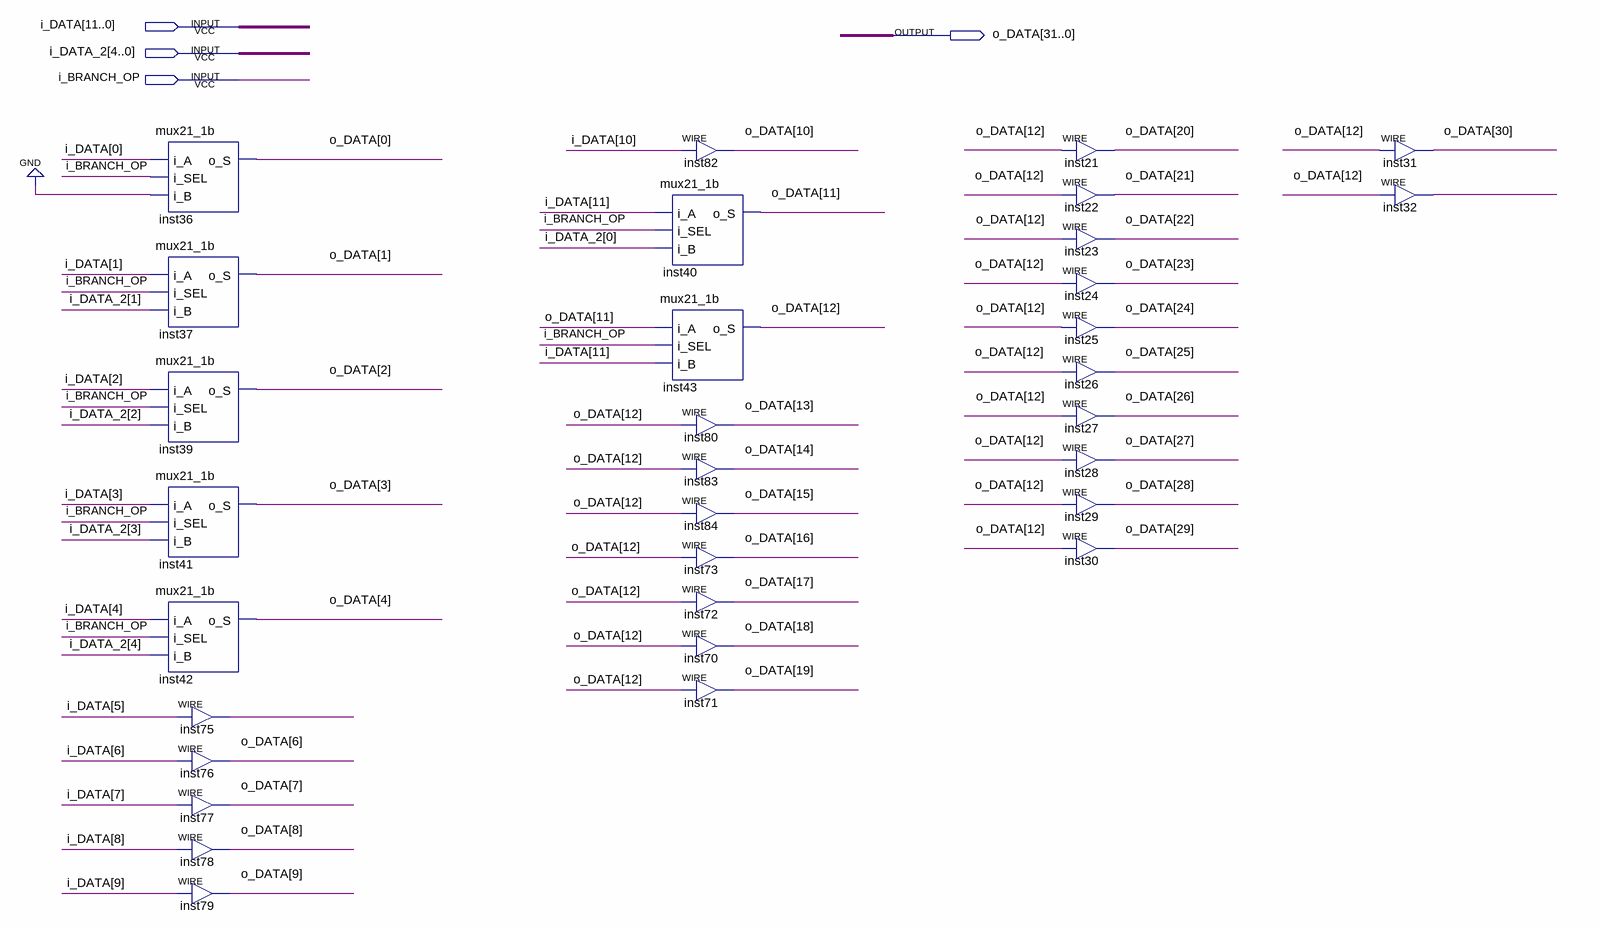
[diagram p0: schematic sheet]
// Quartus schematic signal_ext12_32.bdf as structural Verilog: 32 symbols, 4 pins
module signal_ext12_32 (
  input  [11:0] i_DATA,
  input  [4:0] i_DATA_2,
  input  i_BRANCH_OP,
  output [31:0] o_DATA
);

  wire inst32_out, inst75_out;

  mux21_1b inst36 (.i_A(i_DATA[0]), .i_SEL(i_BRANCH_OP), .i_B(1'b0), .o_S(o_DATA[0]));
  mux21_1b inst37 (.i_A(i_DATA[1]), .i_SEL(i_BRANCH_OP), .i_B(i_DATA_2[1]), .o_S(o_DATA[1]));
  mux21_1b inst39 (.i_A(i_DATA[2]), .i_SEL(i_BRANCH_OP), .i_B(i_DATA_2[2]), .o_S(o_DATA[2]));
  mux21_1b inst41 (.i_A(i_DATA[3]), .i_SEL(i_BRANCH_OP), .i_B(i_DATA_2[3]), .o_S(o_DATA[3]));
  mux21_1b inst42 (.i_A(i_DATA[4]), .i_SEL(i_BRANCH_OP), .i_B(i_DATA_2[4]), .o_S(o_DATA[4]));
  assign inst75_out = i_DATA[5];  // WIRE inst75
  assign o_DATA[6] = i_DATA[6];  // WIRE inst76
  assign o_DATA[7] = i_DATA[7];  // WIRE inst77
  assign o_DATA[8] = i_DATA[8];  // WIRE inst78
  assign o_DATA[9] = i_DATA[9];  // WIRE inst79
  mux21_1b inst40 (.i_A(i_DATA[11]), .i_SEL(i_BRANCH_OP), .i_B(i_DATA_2[0]), .o_S(o_DATA[11]));
  mux21_1b inst43 (.i_A(o_DATA[11]), .i_SEL(i_BRANCH_OP), .i_B(i_DATA[11]), .o_S(o_DATA[12]));
  assign o_DATA[10] = i_DATA[10];  // WIRE inst82
  assign o_DATA[13] = o_DATA[12];  // WIRE inst80
  assign o_DATA[14] = o_DATA[12];  // WIRE inst83
  assign o_DATA[15] = o_DATA[12];  // WIRE inst84
  assign o_DATA[16] = o_DATA[12];  // WIRE inst73
  assign o_DATA[17] = o_DATA[12];  // WIRE inst72
  assign o_DATA[18] = o_DATA[12];  // WIRE inst70
  assign o_DATA[19] = o_DATA[12];  // WIRE inst71
  assign o_DATA[20] = o_DATA[12];  // WIRE inst21
  assign o_DATA[21] = o_DATA[12];  // WIRE inst22
  assign o_DATA[22] = o_DATA[12];  // WIRE inst23
  assign o_DATA[23] = o_DATA[12];  // WIRE inst24
  assign o_DATA[24] = o_DATA[12];  // WIRE inst25
  assign o_DATA[25] = o_DATA[12];  // WIRE inst26
  assign o_DATA[26] = o_DATA[12];  // WIRE inst27
  assign o_DATA[27] = o_DATA[12];  // WIRE inst28
  assign o_DATA[28] = o_DATA[12];  // WIRE inst29
  assign o_DATA[29] = o_DATA[12];  // WIRE inst30
  assign o_DATA[30] = o_DATA[12];  // WIRE inst31
  assign inst32_out = o_DATA[12];  // WIRE inst32
endmodule
